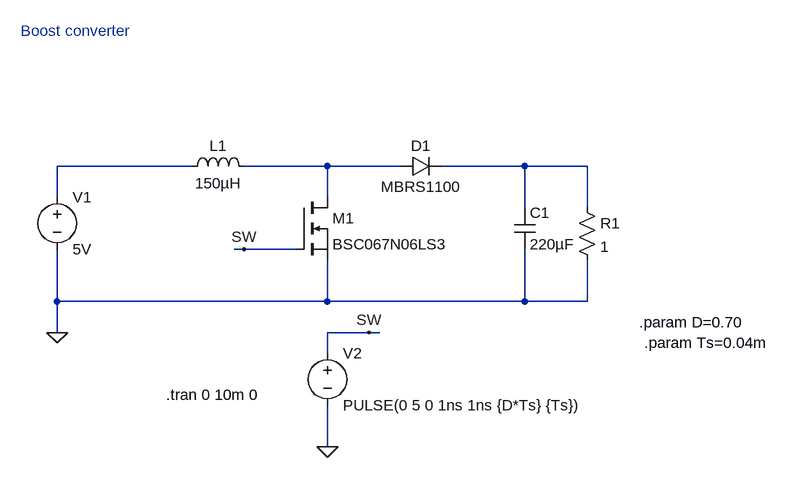
[diagram p0: schematic Boost_converter.asc]
Boost_converter.asc, the LTspice schematic file:
Version 4.1
SHEET 1 1160 680
WIRE 256 176 48 176
WIRE 464 176 336 176
WIRE 576 176 464 176
WIRE 768 176 640 176
WIRE 864 176 768 176
WIRE 48 224 48 176
WIRE 464 224 464 176
WIRE 768 240 768 176
WIRE 864 240 864 176
WIRE 336 304 320 304
WIRE 416 304 336 304
WIRE 48 384 48 304
WIRE 464 384 464 320
WIRE 464 384 48 384
WIRE 768 384 768 304
WIRE 768 384 464 384
WIRE 864 384 864 320
WIRE 864 384 768 384
WIRE 48 432 48 384
WIRE 528 432 464 432
WIRE 544 432 528 432
WIRE 464 464 464 432
WIRE 464 608 464 544
FLAG 48 432 0
FLAG 464 608 0
FLAG 528 432 SW
FLAG 336 304 SW
SYMBOL voltage 48 208 R0
WINDOW 123 0 0 Left 0
WINDOW 39 0 0 Left 0
SYMATTR InstName V1
SYMATTR Value 5V
SYMBOL ind 240 192 R270
WINDOW 0 32 56 VTop 2
WINDOW 3 5 56 VBottom 2
SYMATTR InstName L1
SYMATTR Value 150µH
SYMBOL diode 576 192 R270
WINDOW 0 32 32 VTop 2
WINDOW 3 0 32 VBottom 2
SYMATTR InstName D1
SYMATTR Value MBRS1100
SYMATTR Description Diode
SYMATTR Type diode
SYMBOL cap 752 240 R0
SYMATTR InstName C1
SYMATTR Value 220µF
SYMBOL res 848 224 R0
SYMATTR InstName R1
SYMATTR Value 1
SYMBOL voltage 464 448 R0
WINDOW 123 0 0 Left 0
WINDOW 39 0 0 Left 0
SYMATTR InstName V2
SYMATTR Value PULSE(0 5 0 1ns 1ns {D*Ts} {Ts})
SYMBOL nmos 416 224 R0
SYMATTR InstName M1
SYMATTR Value BSC067N06LS3
TEXT -8 -32 Left 2 ;Boost converter
TEXT 944 416 Left 2 !.param D=0.70
TEXT 952 448 Left 2 !.param Ts=0.04m
TEXT 216 528 Left 2 !.tran 0 10m 0

The netlist it stands for:
* Boost_converter.asc
V1 N001 0 5V
L1 N001 N002 150µH
D1 N002 N003 MBRS1100
C1 N003 0 220µF
R1 N003 0 1
V2 SW 0 PULSE(0 5 0 1ns 1ns {D*Ts} {Ts})
M1 N002 SW 0 0 BSC067N06LS3
.model D D
.lib standard.dio
.model NMOS NMOS
.model PMOS PMOS
.lib standard.mos
* Boost converter
.param D=0.70
.param Ts=0.04m
.tran 0 10m 0
.backanno
.end